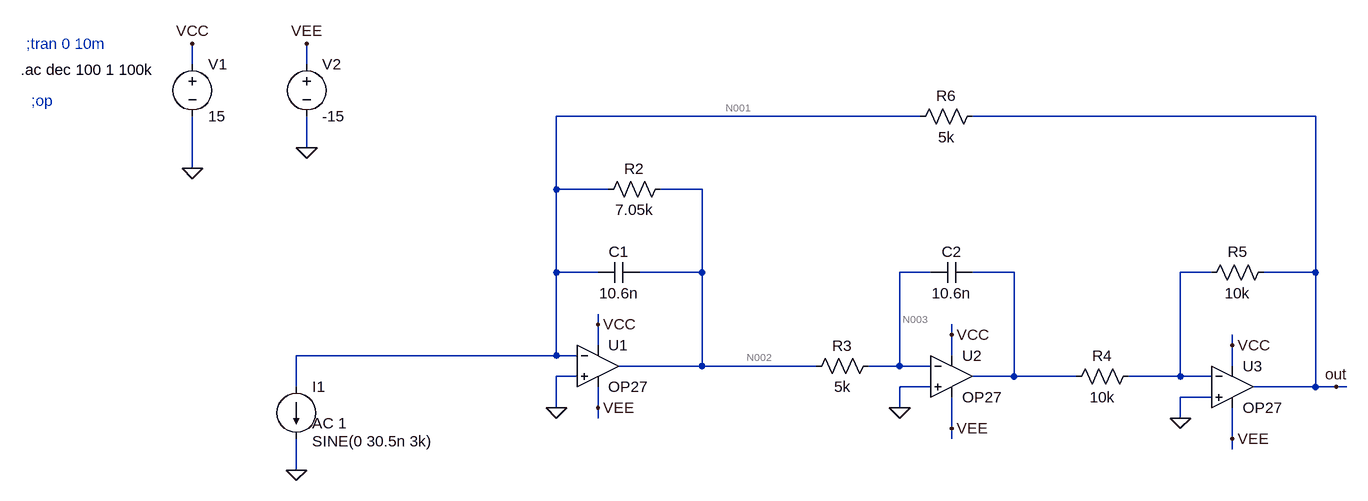
[diagram p0: schematic etaj2-AC-banda in castig.asc]
etaj2-AC-banda in castig.asc, the LTspice schematic file:
Version 4.1
SHEET 1 2284 1120
WIRE 400 -32 400 -64
WIRE 576 -32 576 -64
WIRE 1520 48 960 48
WIRE 2128 48 1600 48
WIRE 576 96 576 48
WIRE 400 128 400 48
WIRE 960 160 960 48
WIRE 1040 160 960 160
WIRE 1184 160 1120 160
WIRE 960 288 960 160
WIRE 1024 288 960 288
WIRE 1184 288 1184 160
WIRE 1184 288 1088 288
WIRE 1536 288 1488 288
WIRE 1664 288 1600 288
WIRE 1968 288 1920 288
WIRE 2128 288 2128 48
WIRE 2128 288 2048 288
WIRE 1024 368 1024 352
WIRE 1568 384 1568 368
WIRE 1024 400 1024 368
WIRE 2000 400 2000 384
WIRE 960 416 960 288
WIRE 960 416 560 416
WIRE 992 416 960 416
WIRE 1568 416 1568 384
WIRE 1184 432 1184 288
WIRE 1184 432 1056 432
WIRE 1360 432 1184 432
WIRE 1488 432 1488 288
WIRE 1488 432 1440 432
WIRE 1536 432 1488 432
WIRE 2000 432 2000 400
WIRE 992 448 960 448
WIRE 1664 448 1664 288
WIRE 1664 448 1600 448
WIRE 1760 448 1664 448
WIRE 1920 448 1920 288
WIRE 1920 448 1840 448
WIRE 1968 448 1920 448
WIRE 560 464 560 416
WIRE 1536 464 1488 464
WIRE 2128 464 2128 288
WIRE 2128 464 2032 464
WIRE 2160 464 2128 464
WIRE 2176 464 2160 464
WIRE 1968 480 1920 480
WIRE 960 496 960 448
WIRE 1024 496 1024 464
WIRE 1488 496 1488 464
WIRE 1024 512 1024 496
WIRE 1920 512 1920 480
WIRE 1568 528 1568 480
WIRE 1568 544 1568 528
WIRE 2000 544 2000 496
WIRE 2000 560 2000 544
WIRE 560 592 560 544
FLAG 400 -64 VCC
FLAG 576 -64 VEE
FLAG 960 496 0
FLAG 1488 496 0
FLAG 1920 512 0
FLAG 560 592 0
FLAG 400 128 0
FLAG 1024 368 VCC
FLAG 1568 384 VCC
FLAG 2000 400 VCC
FLAG 1024 496 VEE
FLAG 1568 528 VEE
FLAG 2000 544 VEE
FLAG 2160 464 out
FLAG 576 96 0
SYMBOL voltage 400 -48 R0
WINDOW 123 0 0 Left 2
WINDOW 39 0 0 Left 2
SYMATTR InstName V1
SYMATTR Value 15
SYMBOL voltage 576 -48 R0
WINDOW 123 0 0 Left 2
WINDOW 39 0 0 Left 2
SYMATTR InstName V2
SYMATTR Value -15
SYMBOL res 1136 144 R90
WINDOW 0 0 56 VBottom 2
WINDOW 3 32 56 VTop 2
SYMATTR InstName R2
SYMATTR Value 7.05k
SYMBOL res 1456 416 R90
WINDOW 0 0 56 VBottom 2
WINDOW 3 32 56 VTop 2
SYMATTR InstName R3
SYMATTR Value 5k
SYMBOL res 1856 432 R90
WINDOW 0 0 56 VBottom 2
WINDOW 3 32 56 VTop 2
SYMATTR InstName R4
SYMATTR Value 10k
SYMBOL res 2064 272 R90
WINDOW 0 0 56 VBottom 2
WINDOW 3 32 56 VTop 2
SYMATTR InstName R5
SYMATTR Value 10k
SYMBOL cap 1088 272 R90
WINDOW 0 0 32 VBottom 2
WINDOW 3 32 32 VTop 2
SYMATTR InstName C1
SYMATTR Value 10.6n
SYMBOL cap 1600 272 R90
WINDOW 0 0 32 VBottom 2
WINDOW 3 32 32 VTop 2
SYMATTR InstName C2
SYMATTR Value 10.6n
SYMBOL res 1616 32 R90
WINDOW 0 0 56 VBottom 2
WINDOW 3 32 56 VTop 2
SYMATTR InstName R6
SYMATTR Value 5k
SYMBOL OpAmps\\OP27 1024 368 R0
SYMATTR InstName U1
SYMBOL OpAmps\\OP27 1568 384 R0
SYMATTR InstName U2
SYMBOL OpAmps\\OP27 2000 400 R0
SYMATTR InstName U3
SYMBOL current 560 464 R0
WINDOW 3 24 84 Left 2
WINDOW 123 24 56 Left 2
WINDOW 39 0 0 Left 0
SYMATTR InstName I1
SYMATTR Value SINE(0 30.5n 3k)
SYMATTR Value2 AC 1
TEXT 136 -24 Left 2 !.ac dec 100 1 100k
TEXT 152 24 Left 2 ;;op
TEXT 144 -64 Left 2 ;;tran 0 10m

The netlist it stands for:
* etaj2-AC-banda in castig.asc
V1 VCC 0 15
V2 VEE 0 -15
R2 N002 N001 7.05k
R3 N003 N002 5k
R4 N005 N004 10k
R5 out N005 10k
C1 N002 N001 10.6n
C2 N004 N003 10.6n
R6 out N001 5k
X§U1 0 N001 VCC VEE N002 OP27  ; pins In+ In- V+ V- OUT
X§U2 0 N003 VCC VEE N004 OP27  ; pins In+ In- V+ V- OUT
X§U3 0 N005 VCC VEE out OP27  ; pins In+ In- V+ V- OUT
I1 N001 0 SINE(0 30.5n 3k) AC 1
.ac dec 100 1 100k
* ;op
* ;tran 0 10m
.lib ADI.lib
.backanno
.end

* Results of the author's LTspice run, read from the files saved beside the schematic
* Operating Point, zero values left out:
*   V(vee) = -15 V
*   V(vcc) = 15 V
*   I(V1) = -8.903 mA
*   I(V2) = 8.903 mA
*   Ix(u2:3) = 2.968 mA
*   Ix(u2:4) = -2.968 mA
*   Ix(u1:3) = 2.968 mA
*   Ix(u1:4) = -2.968 mA
*   Ix(u3:3) = 2.968 mA
*   Ix(u3:4) = -2.968 mA
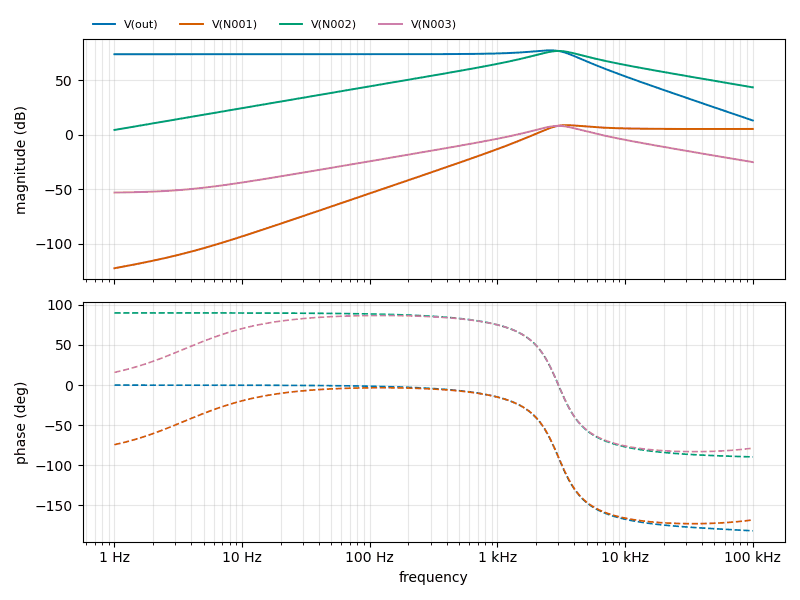
[diagram p1: AC Analysis of etaj2-AC-banda in castig.asc, plotted from the saved traces]
* AC Analysis, 1 run:
*   V(out): 73.98 dB at 1 Hz, 13.13 dB at 100 kHz, peak 77.56 dB at 2.57 kHz, 3 dB below the peak at 886.3 Hz and 3.567 kHz
*   V(N001): -122.56 dB at 1 Hz, 5.39 dB at 100 kHz, peak 8.84 dB at 3.467 kHz, 3 dB below the peak at 2.527 kHz and 10.15 kHz
*   V(N002): 4.43 dB at 1 Hz, 43.55 dB at 100 kHz, peak 76.98 dB at 3.02 kHz, 3 dB below the peak at 2.122 kHz and 4.247 kHz
*   V(N003): -53.06 dB at 1 Hz, -25.09 dB at 100 kHz, peak 8.21 dB at 3.02 kHz, 3 dB below the peak at 2.122 kHz and 4.247 kHz